# Altium project Power_Embedded_Board.PrjPcb
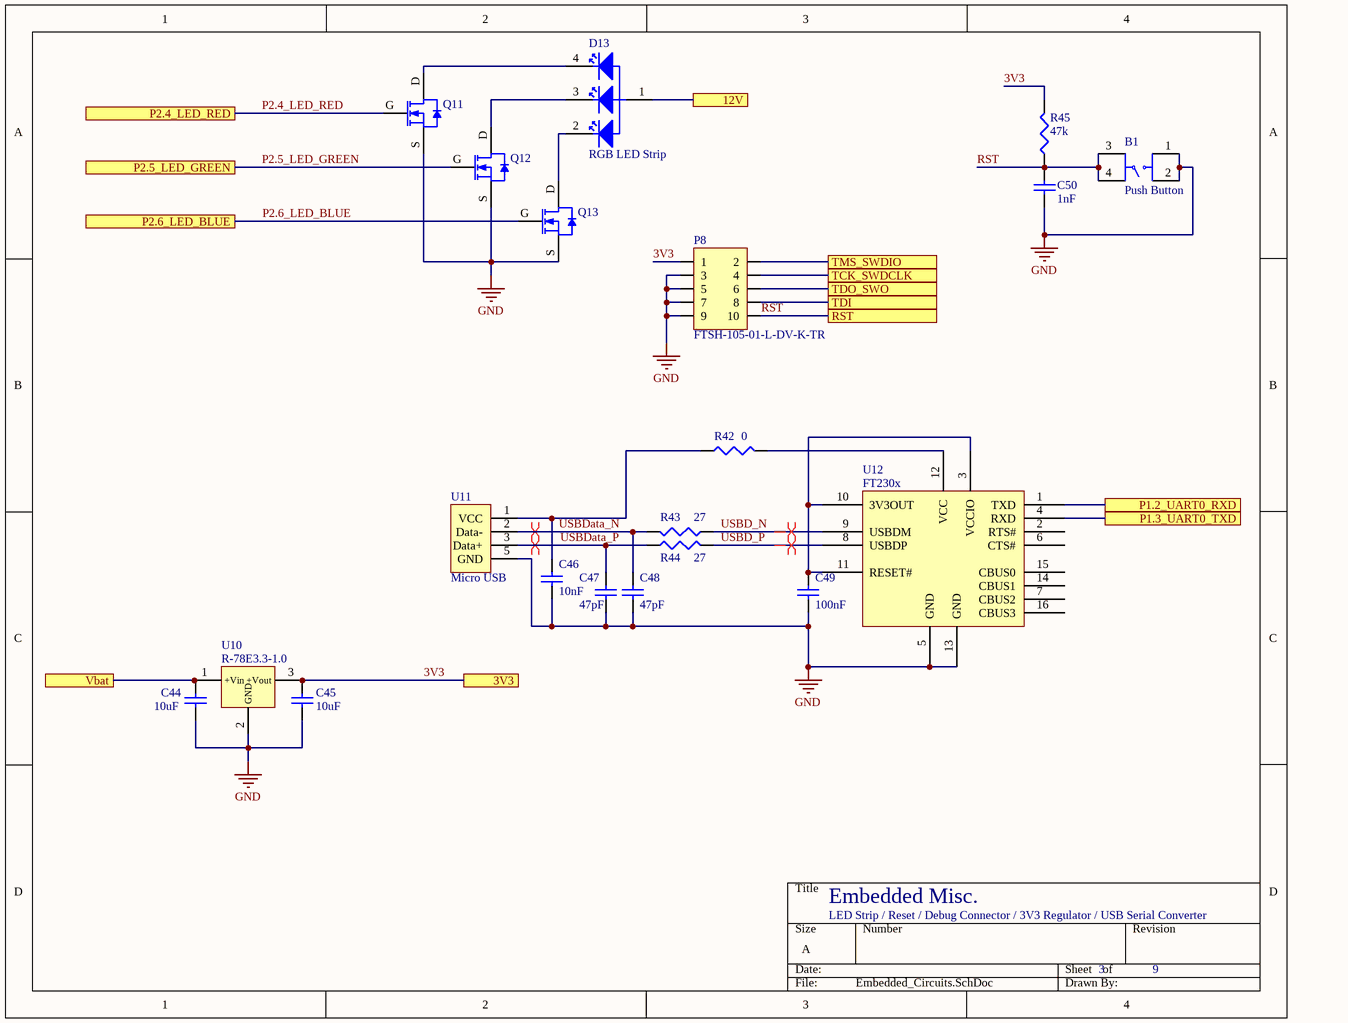
[diagram p0: Embedded_Circuits.SchDoc]
5 sheets, 122 parts. Net scope: flat (ports and power ports of the same name join across sheets).
Board file: Power_Embedded_Board.PcbDoc
Sheets:
  Embedded_Circuits.SchDoc
  Embedded_Chip.SchDoc
  12V_Converter.SchDoc
  19V_Converter.SchDoc
  48V_Converter2.SchDoc

## Sheet Embedded_Circuits.SchDoc
size A; SheetNumber: 3; SheetTotal: 9

### Parts
B1  Push Button  [Push Button]
C44  value 10uF  [C1206]  (hidden comment: Cap)
C45  value 10uF  [C1206]  (hidden comment: Cap)
C46  value 10nF  [C1206]  (hidden comment: Cap)
C47  value 47pF  [C1206]  (hidden comment: Cap)
C48  value 47pF  [C1206]  (hidden comment: Cap)
C49  value 100nF  [C1206]  (hidden comment: Cap)
C50  value 1nF  [C1206]  (hidden comment: Cap Semi)
D13  RGB LED Strip  [Header 1x4]
P8  FTSH-105-01-L-DV-K-TR  [FTSH-105-01-L-DV-K-TR]
Q11  DMN1019USN  [DMN1019USN]  (value not drawn)
Q12  DMN1019USN  [DMN1019USN]  (value not drawn)
Q13  DMN1019USN  [DMN1019USN]  (value not drawn)
R42  value 0  [J1-0603]  (hidden comment: Res3)
R43  value 27  [J1-0603]  (hidden comment: Res3)
R44  value 27  [J1-0603]  (hidden comment: Res3)
R45  value 47k  [J1-0603]  (hidden comment: Res3)
U10  R-78E3.3-1.0  [R-78Exx-1.0]
U11  Micro USB  [Micro USB]
U12  FT230x  [FT230X]

### Ports
3V3, 12V, P1.2_UART0_RXD, P1.3_UART0_TXD, P2.4_LED_RED, P2.5_LED_GREEN, P2.6_LED_BLUE, RST, TCK_SWDCLK, TDI, TDO_SWO, TMS_SWDIO, Vbat

### Nets
GND: B1.1 B1.2 C44.1 C45.1 C46.1 C47.1 C48.1 C49.1 C50.1 P8.3 P8.5 P8.7 P8.9 Q11.S Q12.S Q13.S U10.2(GND) U11.5(GND) U12.5(GND) U12.13(GND)
3V3: C45.2 P8.1 R45.2 U10.3(+Vout) ; port 3V3
P1.2_UART0_RXD: U12.1(TXD) ; port P1.2_UART0_RXD
P1.3_UART0_TXD: U12.4(RXD) ; port P1.3_UART0_TXD
P2.4_LED_RED: Q11.G ; port P2.4_LED_RED
P2.5_LED_GREEN: Q12.G ; port P2.5_LED_GREEN
P2.6_LED_BLUE: Q13.G ; port P2.6_LED_BLUE
RST: B1.3 B1.4 C50.2 P8.10 R45.1 ; port RST
TCK_SWDCLK: P8.4 ; port TCK_SWDCLK
TDI: P8.8 ; port TDI
TDO_SWO: P8.6 ; port TDO_SWO
TMS_SWDIO: P8.2 ; port TMS_SWDIO
USBD_N: R43.1 U12.9(USBDM)
USBD_P: R44.2 U12.8(USBDP)
USBData_N: C48.2 R43.2 U11.2(Data-)
USBData_P: C47.2 R44.1 U11.3(Data+)
Vbat: C44.2 U10.1(+Vin) ; port Vbat
NetC46_2: C46.2 R42.1 U11.1(VCC)
NetC49_2: C49.2 U12.3(VCCIO) U12.10(3V3OUT) U12.11(RESET#)
NetD13_1: D13.1 ; port 12V
NetD13_2: D13.2 Q13.D
NetD13_3: D13.3 Q12.D
NetD13_4: D13.4 Q11.D
NetR42_2: R42.2 U12.12(VCC)

Not connected (* = marked no-connect by the designer): U12 2(RTS#) 6(CTS#) 7(CBUS2) 14(CBUS1) 15(CBUS0) 16(CBUS3)

### Layout directives
differential pair: USBD_N, USBD_P, USBData_N, USBData_P

### Notes on the sheet
- Embedded Misc.
- LED Strip / Reset / Debug Connector / 3V3 Regulator / USB Serial Converter

### Library data of the parts
B1 = Push Button: Tactile Switch SPST-NO Top Actuated Through Hole; Digikey Link: https://www.digikey.com/product-detail/en/te-connectivity-alcoswitch-switches/FSM101/450-1157-ND/701084; Drawing: https://www.te.com/commerce/DocumentDelivery/DDEController?Action=srchrtrv&DocNm=1571140&DocType=Customer+Drawing&DocLang=English
C44-C49 = Cap: Capacitor; Published: 8-Jun-2000; LatestRevisionDate: 17-Jul-2002; LatestRevisionNote: Re-released for DXP Platform.; PackageReference: RAD-0.3; Publisher: Altium Limited; PackageDescription: Radial Cap, Thru-Hole; 2 Leads; 0.3 in Pin Spacing; Supplier 1: Digi-Key
  C44 C45: Supplier Part Number 1: 1276-2872-1-ND
  C46: Supplier Part Number 1: 1276-1921-1-ND
  C47 C48: Supplier Part Number 1: 490-16375-1-ND
  C49: Supplier Part Number 1: 1276-1001-1-ND
C50 = Cap Semi: Capacitor (Semiconductor SIM Model); Published: 8-Jun-2000; LatestRevisionDate: 29-May-2009; LatestRevisionNote: IPC-7351 Footprint Added.; PackageReference: C1206; Publisher: Altium Limited; PackageDescription: Chip Capacitor; Supplier 1: Digi-Key; Supplier Part Number 1: 490-4761-1-ND
D13 = RGB LED Strip: LED RGB Strip - Bare Nonaddressable; Sparkfun Link: https://www.sparkfun.com/products/12021
P8 = JTAG Header: CONN HEADER 10POS DUAL .05" SMD; Digikey Link: https://www.digikey.com/product-detail/en/samtec-inc/FTSH-105-01-L-DV-K-TR/SAM13165CT-ND/8827920; Drawings: http://suddendocs.samtec.com/prints/ftsh-1xx-xx-xxx-dv-xxx-xxx-mkt.pdf; Datasheet: http://suddendocs.samtec.com/catalog_english/ftsh_smt.pdf
Q11-Q13 = DMN1019USN: 12V N-Channel Enhancement Mode MOSFET; Datasheet: https://www.diodes.com/assets/Datasheets/DMN1019USN.pdf
R42-R45 = Res3: Resistor; Published: 8-Jun-2000; LatestRevisionDate: 29-May-2009; LatestRevisionNote: IPC-7351 Footprint Added.; PackageReference: J1-0603; Publisher: Altium Limited; PackageDescription: Chip Resistor
U10 = R-78Exx-1.0: 1A DC/DC Voltage Converter; Datasheet: https://www.recom-power.com/pdf/Innoline/R-78Exx-0.5.pdf
U11 = Micro USB: USB - micro B USB 2.0 Receptacle Connector 5 Position Surface Mount, Right Angle; Digikey: https://www.digikey.com/product-detail/en/molex-llc/1050170001/WM1399CT-ND/2350885; Datasheet: https://www.molex.com/pdm_docs/sd/1050170001_sd.pdf
U12 = FTDI FT230x: USB to Basic UART IC; Datasheet: https://www.ftdichip.com/Support/Documents/DataSheets/ICs/DS_FT230X.pdf

## Sheet Embedded_Chip.SchDoc
size A; SheetNumber: 4; SheetTotal: 9
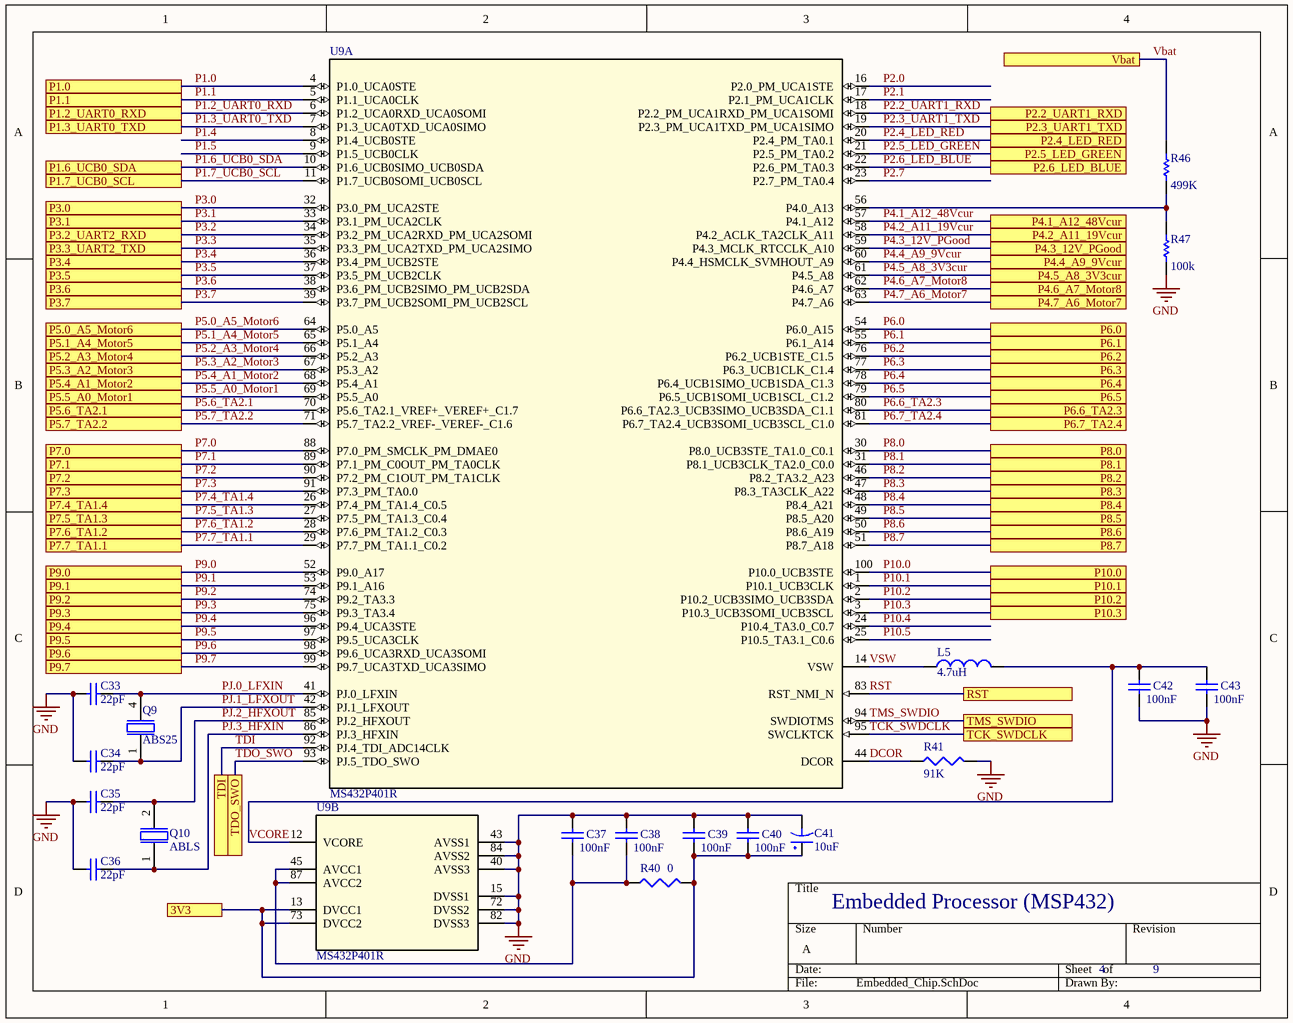
[diagram p1: Embedded_Chip.SchDoc]

### Parts
C33  value 22pF  [C1206]  (hidden comment: Cap Semi)
C34  value 22pF  [C1206]  (hidden comment: Cap Semi)
C35  value 22pF  [C1206]  (hidden comment: Cap Semi)
C36  value 22pF  [C1206]  (hidden comment: Cap Semi)
C37  value 100nF  [C1206]  (hidden comment: Cap Semi)
C38  value 100nF  [C1206]  (hidden comment: Cap Semi)
C39  value 100nF  [C1206]  (hidden comment: Cap Semi)
C40  value 100nF  [C1206]  (hidden comment: Cap Semi)
C41  10uF  [UWX1C100MCL2GB]
C42  value 100nF  [C1206]  (hidden comment: Cap Semi)
C43  value 100nF  [C1206]  (hidden comment: Cap Semi)
L5  value 4.7uH  [0806 (Metric 2016)]  (hidden comment: Inductor)
Q9  ABS25  [ABS25]
Q10  ABLS  [ABLS]
R40  value 0  [J1-0603]  (hidden comment: Res3)
R41  value 91K  [J1-0603]  (hidden comment: Res3)
R46  value 499K  [J1-0603]  (hidden comment: Res1)
R47  value 100k  [J1-0603]  (hidden comment: Res1)
U9  MS432P401R  [PZ0100A_M]  (parts A,B of 2)

### Ports
3V3, P1.0, P1.1, P1.2_UART0_RXD, P1.3_UART0_TXD, P1.6_UCB0_SDA, P1.7_UCB0_SCL, P2.2_UART1_RXD, P2.3_UART1_TXD, P2.4_LED_RED, P2.5_LED_GREEN, P2.6_LED_BLUE, P3.0, P3.1, P3.2_UART2_RXD, P3.3_UART2_TXD, P3.4, P3.5, P3.6, P3.7, P4.1_A12_48Vcur, P4.2_A11_19Vcur, P4.3_12V_PGood, P4.4_A9_9Vcur, P4.5_A8_3V3cur, P4.6_A7_Motor8, P4.7_A6_Motor7, P5.0_A5_Motor6, P5.1_A4_Motor5, P5.2_A3_Motor4, P5.3_A2_Motor3, P5.4_A1_Motor2, P5.5_A0_Motor1, P5.6_TA2.1, P5.7_TA2.2, P6.0, P6.1, P6.2, P6.3, P6.4, P6.5, P6.6_TA2.3, P6.7_TA2.4, P7.0, P7.1, P7.2, P7.3, P7.4_TA1.4, P7.5_TA1.3, P7.6_TA1.2, P7.7_TA1.1, P8.0, P8.1, P8.2, P8.3, P8.4, P8.5, P8.6, P8.7, P9.0, P9.1, P9.2, P9.3, P9.4, P9.5, P9.6, P9.7, P10.0, P10.1, P10.2, P10.3, RST, TCK_SWDCLK, TDI, TDO_SWO, TMS_SWDIO, Vbat

### Nets
GND: C33.1 C34.1 C35.1 C36.1 C37.2 C38.2 C39.2 C40.2 C41.2 C42.1 C43.1 R41.2 R47.1 U9.15(DVSS1) U9.40(AVSS3) U9.43(AVSS1) U9.72(DVSS2) U9.82(DVSS3) U9.84(AVSS2)
3V3: C39.1 C40.1 C41.1 R40.2 U9.13(DVCC1) U9.73(DVCC2) ; port 3V3
DCOR: R41.1 U9.44(DCOR)
P1.0: U9.4(P1.0_UCA0STE) ; port P1.0
P1.1: U9.5(P1.1_UCA0CLK) ; port P1.1
P1.2_UART0_RXD: U9.6(P1.2_UCA0RXD_UCA0SOMI) ; port P1.2_UART0_RXD
P1.3_UART0_TXD: U9.7(P1.3_UCA0TXD_UCA0SIMO) ; port P1.3_UART0_TXD
P1.4: U9.8(P1.4_UCB0STE)
P1.5: U9.9(P1.5_UCB0CLK)
P1.6_UCB0_SDA: U9.10(P1.6_UCB0SIMO_UCB0SDA) ; port P1.6_UCB0_SDA
P1.7_UCB0_SCL: U9.11(P1.7_UCB0SOMI_UCB0SCL) ; port P1.7_UCB0_SCL
P2.0: U9.16(P2.0_PM_UCA1STE)
P2.1: U9.17(P2.1_PM_UCA1CLK)
P2.2_UART1_RXD: U9.18(P2.2_PM_UCA1RXD_PM_UCA1SOMI) ; port P2.2_UART1_RXD
P2.3_UART1_TXD: U9.19(P2.3_PM_UCA1TXD_PM_UCA1SIMO) ; port P2.3_UART1_TXD
P2.4_LED_RED: U9.20(P2.4_PM_TA0.1) ; port P2.4_LED_RED
P2.5_LED_GREEN: U9.21(P2.5_PM_TA0.2) ; port P2.5_LED_GREEN
P2.6_LED_BLUE: U9.22(P2.6_PM_TA0.3) ; port P2.6_LED_BLUE
P2.7: U9.23(P2.7_PM_TA0.4)
P3.0: U9.32(P3.0_PM_UCA2STE) ; port P3.0
P3.1: U9.33(P3.1_PM_UCA2CLK) ; port P3.1
P3.2: U9.34(P3.2_PM_UCA2RXD_PM_UCA2SOMI) ; port P3.2_UART2_RXD
P3.3: U9.35(P3.3_PM_UCA2TXD_PM_UCA2SIMO) ; port P3.3_UART2_TXD
P3.4: U9.36(P3.4_PM_UCB2STE) ; port P3.4
P3.5: U9.37(P3.5_PM_UCB2CLK) ; port P3.5
P3.6: U9.38(P3.6_PM_UCB2SIMO_PM_UCB2SDA) ; port P3.6
P3.7: U9.39(P3.7_PM_UCB2SOMI_PM_UCB2SCL) ; port P3.7
P4.1_A12_48Vcur: U9.57(P4.1_A12) ; port P4.1_A12_48Vcur
P4.2_A11_19Vcur: U9.58(P4.2_ACLK_TA2CLK_A11) ; port P4.2_A11_19Vcur
P4.3_12V_PGood: U9.59(P4.3_MCLK_RTCCLK_A10) ; port P4.3_12V_PGood
P4.4_A9_9Vcur: U9.60(P4.4_HSMCLK_SVMHOUT_A9) ; port P4.4_A9_9Vcur
P4.5_A8_3V3cur: U9.61(P4.5_A8) ; port P4.5_A8_3V3cur
P4.6_A7_Motor8: U9.62(P4.6_A7) ; port P4.6_A7_Motor8
P4.7_A6_Motor7: U9.63(P4.7_A6) ; port P4.7_A6_Motor7
P5.0_A5_Motor6: U9.64(P5.0_A5) ; port P5.0_A5_Motor6
P5.1_A4_Motor5: U9.65(P5.1_A4) ; port P5.1_A4_Motor5
P5.2_A3_Motor4: U9.66(P5.2_A3) ; port P5.2_A3_Motor4
P5.3_A2_Motor3: U9.67(P5.3_A2) ; port P5.3_A2_Motor3
P5.4_A1_Motor2: U9.68(P5.4_A1) ; port P5.4_A1_Motor2
P5.5_A0_Motor1: U9.69(P5.5_A0) ; port P5.5_A0_Motor1
P5.6_TA2.1: U9.70(P5.6_TA2.1_VREF+_VEREF+_C1.7) ; port P5.6_TA2.1
P5.7_TA2.2: U9.71(P5.7_TA2.2_VREF-_VEREF-_C1.6) ; port P5.7_TA2.2
P6.0: U9.54(P6.0_A15) ; port P6.0
P6.1: U9.55(P6.1_A14) ; port P6.1
P6.2: U9.76(P6.2_UCB1STE_C1.5) ; port P6.2
P6.3: U9.77(P6.3_UCB1CLK_C1.4) ; port P6.3
P6.4: U9.78(P6.4_UCB1SIMO_UCB1SDA_C1.3) ; port P6.4
P6.5: U9.79(P6.5_UCB1SOMI_UCB1SCL_C1.2) ; port P6.5
P6.6_TA2.3: U9.80(P6.6_TA2.3_UCB3SIMO_UCB3SDA_C1.1) ; port P6.6_TA2.3
P6.7_TA2.4: U9.81(P6.7_TA2.4_UCB3SOMI_UCB3SCL_C1.0) ; port P6.7_TA2.4
P7.0: U9.88(P7.0_PM_SMCLK_PM_DMAE0) ; port P7.0
P7.1: U9.89(P7.1_PM_C0OUT_PM_TA0CLK) ; port P7.1
P7.2: U9.90(P7.2_PM_C1OUT_PM_TA1CLK) ; port P7.2
P7.3: U9.91(P7.3_PM_TA0.0) ; port P7.3
P7.4_TA1.4: U9.26(P7.4_PM_TA1.4_C0.5) ; port P7.4_TA1.4
P7.5_TA1.3: U9.27(P7.5_PM_TA1.3_C0.4) ; port P7.5_TA1.3
P7.6_TA1.2: U9.28(P7.6_PM_TA1.2_C0.3) ; port P7.6_TA1.2
P7.7_TA1.1: U9.29(P7.7_PM_TA1.1_C0.2) ; port P7.7_TA1.1
P8.0: U9.30(P8.0_UCB3STE_TA1.0_C0.1) ; port P8.0
P8.1: U9.31(P8.1_UCB3CLK_TA2.0_C0.0) ; port P8.1
P8.2: U9.46(P8.2_TA3.2_A23) ; port P8.2
P8.3: U9.47(P8.3_TA3CLK_A22) ; port P8.3
P8.4: U9.48(P8.4_A21) ; port P8.4
P8.5: U9.49(P8.5_A20) ; port P8.5
P8.6: U9.50(P8.6_A19) ; port P8.6
P8.7: U9.51(P8.7_A18) ; port P8.7
P9.0: U9.52(P9.0_A17) ; port P9.0
P9.1: U9.53(P9.1_A16) ; port P9.1
P9.2: U9.74(P9.2_TA3.3) ; port P9.2
P9.3: U9.75(P9.3_TA3.4) ; port P9.3
P9.4: U9.96(P9.4_UCA3STE) ; port P9.4
P9.5: U9.97(P9.5_UCA3CLK) ; port P9.5
P9.6: U9.98(P9.6_UCA3RXD_UCA3SOMI) ; port P9.6
P9.7: U9.99(P9.7_UCA3TXD_UCA3SIMO) ; port P9.7
P10.0: U9.100(P10.0_UCB3STE) ; port P10.0
P10.1: U9.1(P10.1_UCB3CLK) ; port P10.1
P10.2: U9.2(P10.2_UCB3SIMO_UCB3SDA) ; port P10.2
P10.3: U9.3(P10.3_UCB3SOMI_UCB3SCL) ; port P10.3
P10.4: U9.24(P10.4_TA3.0_C0.7)
P10.5: U9.25(P10.5_TA3.1_C0.6)
PJ.0_LFXIN: C33.2 Q9.4 U9.41(PJ.0_LFXIN)
PJ.1_LFXOUT: C34.2 Q9.1 U9.42(PJ.1_LFXOUT)
PJ.2_HFXOUT: C35.2 Q10.2 U9.85(PJ.2_HFXOUT)
PJ.3_HFXIN: C36.2 Q10.1 U9.86(PJ.3_HFXIN)
RST: U9.83(RST_NMI_N) ; port RST
TCK_SWDCLK: U9.95(SWCLKTCK) ; port TCK_SWDCLK
TDI: U9.92(PJ.4_TDI_ADC14CLK) ; port TDI
TDO_SWO: U9.93(PJ.5_TDO_SWO) ; port TDO_SWO
TMS_SWDIO: U9.94(SWDIOTMS) ; port TMS_SWDIO
Vbat: R46.2 ; port Vbat
VCORE: C42.2 C43.2 L5.2 U9.12(VCORE)
VSW: L5.1 U9.14(VSW)
NetC37_1: C37.1 C38.1 R40.1 U9.45(AVCC1) U9.87(AVCC2)
NetR46_1: R46.1 R47.2 U9.56(P4.0_A13)

### Notes on the sheet
- Embedded Processor (MSP432)

### Library data of the parts
C33-C40 C42 C43 = Cap Semi: Capacitor (Semiconductor SIM Model); Published: 8-Jun-2000; LatestRevisionDate: 29-May-2009; LatestRevisionNote: IPC-7351 Footprint Added.; PackageReference: C1206; Publisher: Altium Limited; PackageDescription: Chip Capacitor
C41 = UWX1C100MCL2GB: CAP ALUM 10UF 20% 16V SMD; Digikey: https://www.digikey.com/product-detail/en/nichicon/UWX1C100MCL2GB/493-2099-1-ND/590074; Datasheet: http://nichicon-us.com/english/products/pdfs/e-uwx.pdf
L5 = Inductor: Code_IEC: 1005; Published: 8-Jun-2000; LatestRevisionDate: 29-May-2009; LatestRevisionNote: IPC-7351 Footprint Added.; PackageReference: 0402-A; Publisher: Altium Limited; PackageDescription: Chip Inductor; Code_JEITA: 0402; Supplier 1: Digi-Key; Supplier Part Number 1: 732-2956-1-ND
Q9 = ABS25: 32.768 kHz Low Frequency SMD Crystal; Datasheet: https://abracon.com/Resonators/abs25.pdf
Q10 = ABLS: SMD Low Profile Crystal - 3.579545 MHz to 75 MHz; Datasheet: https://abracon.com/Resonators/abls.pdf
R40 R41 = Res3: Resistor; Published: 8-Jun-2000; LatestRevisionDate: 29-May-2009; LatestRevisionNote: IPC-7351 Footprint Added.; PackageReference: J1-0603; Publisher: Altium Limited; PackageDescription: Chip Resistor
R46 R47 = Res1: Resistor; Published: 8-Jun-2000; LatestRevisionDate: 17-Jul-2002; LatestRevisionNote: Re-released for DXP Platform.; PackageReference: AXIAL-0.3; Publisher: Altium Limited; PackageDescription: Axial Device, Thru-Hole; 2 Leads; 0.3 in Pin Spacing
U9 = MS432P401R-IPZR: SimpleLink Ultra-Low-Power 32-Bit ARM Cortex-M4F MCU With Precision ADC, 256KB Flash and 64KB RAM; PartNumber: XMS432P401RIPZR; Manufacturer: Texas Instruments; CompType: IC; PIN_COUNT: 100; PackageReference: PZ0100A; MountType: SMT; RefDes: RefDes; TYPE: TYPE; Value: Value

## Sheet 12V_Converter.SchDoc
size A; SheetNumber: 6; SheetTotal: 9
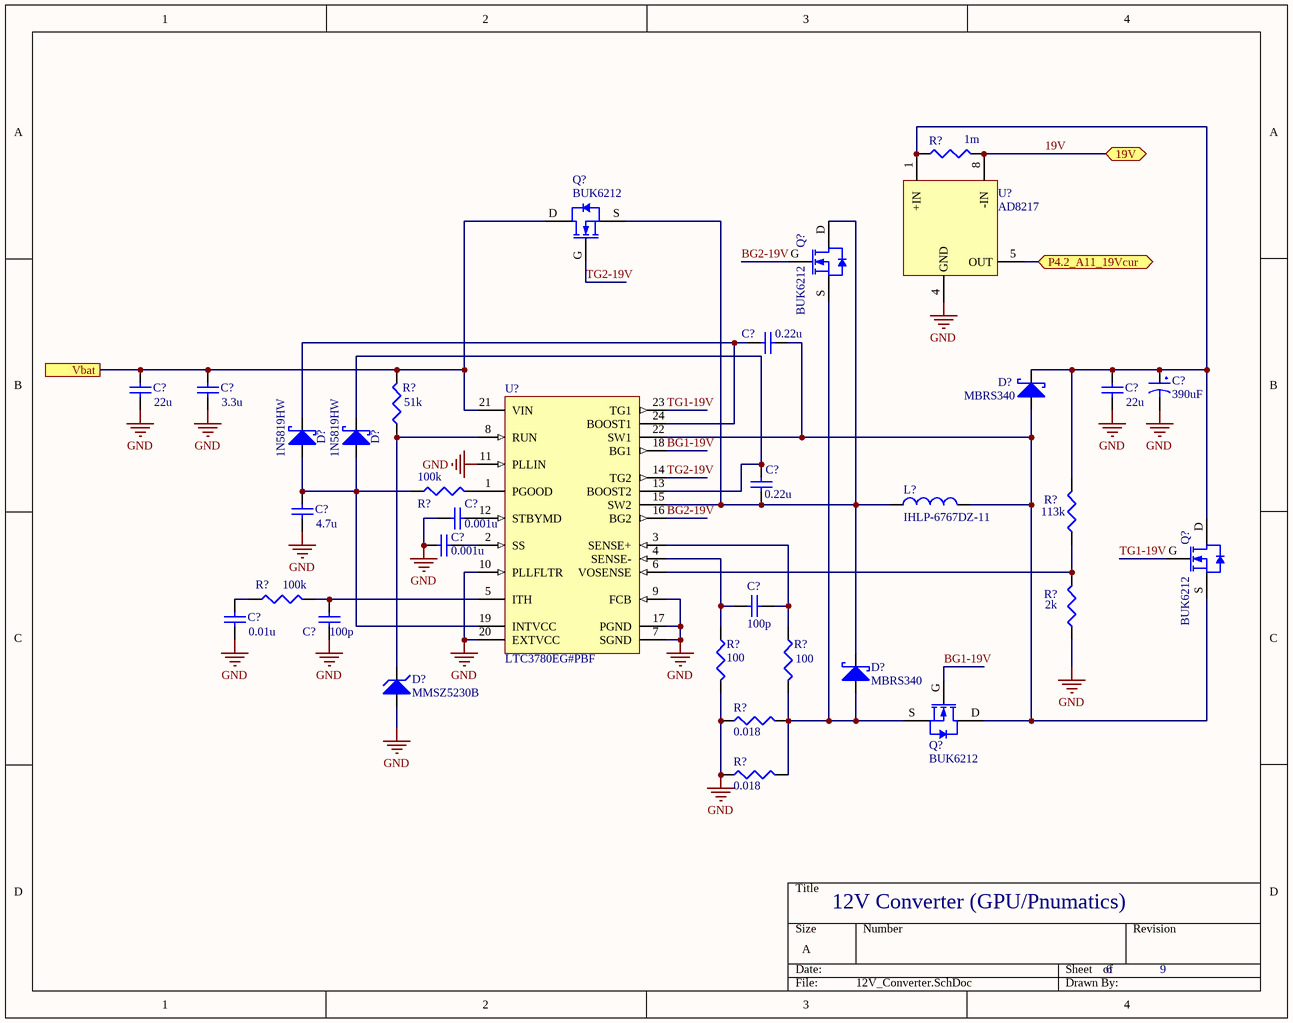
[diagram p2: 12V_Converter.SchDoc]

### Parts
(Parts that share a designator on the sheet are numbered #1, #2 ... from top to bottom, then left to right.)
C?#1  value 0.22u  [C1206]  (hidden comment: Cap Semi)
C?#2  value 22u  [C1206]  (hidden comment: Cap Semi)
C?#3  value 3.3u  [C1206]  (hidden comment: Cap Semi)
C?#4  value 22u  [C1206]  (hidden comment: Cap Semi)
C?#5  390uF  [PCVxxxxxMCLxGS]
C?#6  value 0.22u  [C1206]  (hidden comment: Cap Semi)
C?#7  value 0.001u  [C1206]  (hidden comment: Cap Semi)
C?#8  value 4.7u  [C1206]  (hidden comment: Cap Semi)
C?#9  value 0.001u  [C1206]  (hidden comment: Cap Semi)
C?#10  value 100p  [C1206]  (hidden comment: Cap Semi)
C?#11  value 0.01u  [C1206]  (hidden comment: Cap Semi)
C?#12  value 100p  [C1206]  (hidden comment: Cap Semi)
D?#1  MBRS340  [MBRS340]
D?#2  1N5819HW  [1N58xx]
D?#3  1N5819HW  [1N58xx]
D?#4  MMSZ5230B  [ONSC-SOD-123-2-425-04_V]
D?#5  MBRS340  [MBRS340]
L?  IHLP-6767DZ-11  [IHLP-6767DZ-11]
Q?#1  BUK6212  [NXP-SOT428_M]
Q?#2  BUK6212  [NXP-SOT428_M]
Q?#3  BUK6212  [NXP-SOT428_M]
Q?#4  BUK6212  [NXP-SOT428_M]
R?#1  value 1m  [14-1210]  (hidden comment: Res3)
R?#2  value 51k  [J1-0603]  (hidden comment: Res3)
R?#3  value 100k  [J1-0603]  (hidden comment: Res3)
R?#4  value 113k  [J1-0603]  (hidden comment: Res3)
R?#5  value 100k  [J1-0603]  (hidden comment: Res3)
R?#6  value 2k  [J1-0603]  (hidden comment: Res3)
R?#7  value 100  [J1-0603]  (hidden comment: Res3)
R?#8  value 100  [J1-0603]  (hidden comment: Res3)
R?#9  value 0.018  [R1206]  (hidden comment: Res3)
R?#10  value 0.018  [R1206]  (hidden comment: Res3)
U?#1  AD8217  [AD8217]
U?#2  LTC3780EG#PBF  [LT-G-24_L]

### Ports
19V (bidir), P4.2_A11_19Vcur (bidir), Vbat

### Nets
GND: C?#2.1 C?#3.1 C?#4.1 C?#5.2 C?#7.1 C?#8.1 C?#9.1 C?#11.1 C?#12.1 D?#4.2(A) R?#6.1 R?#7.2 R?#9.1 R?#10.1 U?#1.4(GND) U?#2.7(SGND) U?#2.9(FCB) U?#2.10(PLLFLTR) U?#2.11(PLLIN) U?#2.17(PGND) U?#2.20(EXTVCC)
19V: R?#1.2 U?#1.8(-IN) ; port 19V
BG1-19V: Q?#4.G U?#2.18(BG1)
BG2-19V: Q?#2.G U?#2.16(BG2)
P4.2_A11_19Vcur: U?#1.5(OUT) ; port P4.2_A11_19Vcur
TG1-19V: Q?#3.G U?#2.23(TG1)
TG2-19V: Q?#1.G U?#2.14(TG2)
Vbat: C?#2.2 C?#3.2 Q?#1.D R?#2.2 U?#2.21(VIN) ; port Vbat
NetC?#1_1: C?#1.1 D?#1.A(Anode) L?.2 Q?#3.S Q?#4.D U?#2.22(SW1)
NetC?#1_2: C?#1.2 D?#2.K(Cathode) U?#2.24(BOOST1)
NetC?#4_2: C?#4.2 C?#5.1 D?#1.K(Cathode) Q?#3.D R?#1.1 R?#4.2 U?#1.1(+IN)
NetC?#6_1: C?#6.1 D?#5.K(Cathode) L?.1 Q?#1.S Q?#2.D U?#2.15(SW2)
NetC?#6_2: C?#6.2 D?#3.K(Cathode) U?#2.13(BOOST2)
NetC?#7_2: C?#7.2 U?#2.12(STBYMD)
NetC?#8_2: C?#8.2 D?#2.A(Anode) D?#3.A(Anode) R?#3.1 U?#2.19(INTVCC)
NetC?#9_2: C?#9.2 U?#2.2(SS)
NetC?#10_1: C?#10.1 R?#7.1 U?#2.4(SENSE-)
NetC?#10_2: C?#10.2 R?#8.1 U?#2.3(SENSE+)
NetC?#11_2: C?#11.2 R?#5.1
NetC?#12_2: C?#12.2 R?#5.2 U?#2.5(ITH)
NetD?#4_1: D?#4.1(K) R?#2.1 U?#2.8(RUN)
NetD?#5_A: D?#5.A(Anode) Q?#2.S Q?#4.S R?#8.2 R?#9.2 R?#10.2
NetR?#3_2: R?#3.2 U?#2.1(PGOOD)
NetR?#4_1: R?#4.1 R?#6.2 U?#2.6(VOSENSE)

### Notes on the sheet
- 12V Converter (GPU/Pnumatics)

### Library data of the parts
C?#1-C?#4 C?#6-C?#12 = Cap Semi: Capacitor (Semiconductor SIM Model); Published: 8-Jun-2000; LatestRevisionDate: 29-May-2009; LatestRevisionNote: IPC-7351 Footprint Added.; PackageReference: C1206; Publisher: Altium Limited; PackageDescription: Chip Capacitor
C?#5 = PCV1E391MCL2GS: CAP ALUM POLY 390UF 20% 25V SMD; Digikey: https://www.digikey.com/product-detail/en/nichicon/PCV1E391MCL2GS/493-4544-1-ND/2786841; Datasheet: http://nichicon-us.com/english/products/pdfs/e-pcv.pdf
D?#1 D?#5 = MBRS340: Schottky Rectifier; Datasheet: https://www.mouser.com/ds/2/308/MBRS340-1120985.pdf
D?#2 D?#3 = 1N58xx: 1A Schottky Barrier Rectifier Diode; Datasheet: http://www.kesenes.com/pdf/1n5817-1n5819.pdf
D?#4 = MMSZ5230BT1G: Zener Voltage Regulator, 500 mW, 2-Pin SOD-123, Pb-Free, Tape and Reel; Manufacturer: On Semiconductor; P Max (W): 0.5; VZ Typ (V): 4.7; DatasheetVersion: Rev. 12; PackageVersion: Rev. G, 10/2009; PackageReference: SOD-123-2-425-04; PackageDescription: 2-Pin SOD, Body 1.6 x 2.69 mm; Supplier 1: Digi-Key; Supplier Part Number 1: MMSZ5230BT1GOSTR-ND; Supplier 2: Digi-Key; Supplier Part Number 2: MMSZ5230BT1GOSCT-ND; Supplier 3: Digi-Key; Supplier Part Number 3: MMSZ5230BT1GOSDKR-ND; Supplier 4: Farnell; Supplier Part Number 4: 1431272; Supplier 5: Farnell; Supplier Part Number 5: 1431272RL; Supplier 6: Farnell; Supplier Part Number 6: 2370826; Supplier 7: Newark; Supplier Part Number 7: 83H7423; Supplier 8: Newark; Supplier Part Number 8: 67R1368; Supplier 9: Mouser; Supplier Part Number 9: 863-MMSZ5230BT1G; Packing: Tape and Reel; RoHS: Pb-Free; Mounting Technology: Surface Mount; PartNumber: MMSZ5230BT1G; ComponentLink1Description: Manufacturer URL; ComponentLink1URL: http://www.onsemi.com/; ComponentLink2Description: Datasheet; ComponentLink2URL: http://www.onsemi.com/pub_link/Collateral/MMSZ5221BT1-D.PDF; ComponentLink3Description: Package Specification; ComponentLink3URL: http://www.onsemi.com/pub_link/Collateral/425-04.PDF
L? = IHLP-6767DZ-11: 15µH Shielded Molded Inductor 14A 14.4 mOhm Max Nonstandard; Datasheet: http://www.vishay.com/docs/34306/lp67dz11.pdf; Digikey: https://www.digikey.com/product-detail/en/vishay-dale/IHLP6767GZER150M11/541-1287-1-ND/2139413
Q?#1-Q?#4 = BUK6212: N-Channel TrenchMOS Intermediate Level FET, 40 V, 50 A, 3-Pin SOT428, Tape and Reel; Manufacturer: NXP Semiconductors; PartNumber: BUK6212-40C,118; Automotive Qualified: Y; Channel Type: N; ID [max] (A): 50; IDM [max] (A): 233; Packing: Tape & Reel; Qr [typ] (nC): 38; VDS [max] (V): 40; VGSth [typ] (V): 2.3; DatasheetVersion: Rev. 2; PackageVersion: 14-06-10, 06/2014; PackageReference: SOT428; PackageDescription: 3-Pin Plastic Single-ended Surface Mounted Package, Body 6.1 x 6.6 mm, Pitch 2.285 mm; Supplier 1: Digi-Key; Supplier Part Number 1: 568-6983-2-ND; Supplier 2: Digi-Key; Supplier Part Number 2: 568-6983-1-ND; Supplier 3: Digi-Key; Supplier Part Number 3: 568-6983-6-ND; Supplier 4: Mouser; Supplier Part Number 4: 771-BUK621240C118; Mounting Technology: Surface Mount; Code_JEITA: SC-63; Code_JEDEC: TO-252; ComponentLink1Description: Manufacturer URL; ComponentLink1URL: http://www.nxp.com/; ComponentLink2Description: Datasheet; ComponentLink2URL: http://www.nxp.com/documents/data_sheet/BUK6212-40C.pdf; ComponentLink3Description: Package Specification; ComponentLink3URL: http://www.nxp.com/documents/outline_drawing/sot428_po.pdf
R?#1-R?#10 = Res3: Resistor; Published: 8-Jun-2000; LatestRevisionDate: 29-May-2009; LatestRevisionNote: IPC-7351 Footprint Added.; PackageReference: J1-0603; Publisher: Altium Limited; PackageDescription: Chip Resistor
U?#1 = AD8217: High Resolution, Zero-Drift  Current Shunt Monitor; Datasheet: https://www.analog.com/media/en/technical-documentation/data-sheets/AD8217.pdf
U?#2 = LTC3780EG#PBF: Buck-boost Controller, Constant Frequency, Current Mode Control with Power Good Output, 24-pin SOP (G-24), -40 to 85 degC, Pb-Free; Manufacturer: Linear Technology; Frequency Sync Range: 200kHz - 400kHz; Number of Outputs: 1; DatasheetVersion: Rev. F; PackageVersion: Jun-10; PackageReference: G-24; PackageDescription: 24-Pin Plastic SSOP, Body 8.2 x 5.3 mm, Pitch 0.65 mm; Supplier 1: Digi-Key; Supplier Part Number 1: LTC3780EG#PBF-ND; Supplier 2: Farnell; Supplier Part Number 2: 1273545; Supplier 3: Newark; Supplier Part Number 3: 56M8395; RoHS: TRUE; Mounting Technology: Surface Mount; PartNumber: LTC3780EG#PBF; ComponentLink1Description: Manufacturer URL; ComponentLink1URL: http://www.linear.com/; ComponentLink2Description: Datasheet; ComponentLink2URL: http://cds.linear.com/docs/en/datasheet/3780ff.pdf; ComponentLink3Description: Package Specification; ComponentLink3URL: http://cds.linear.com/docs/en/packaging/SSOP_24_05-08-1640.pdf

## Sheet 19V_Converter.SchDoc
size A; SheetNumber: 7; SheetTotal: 9
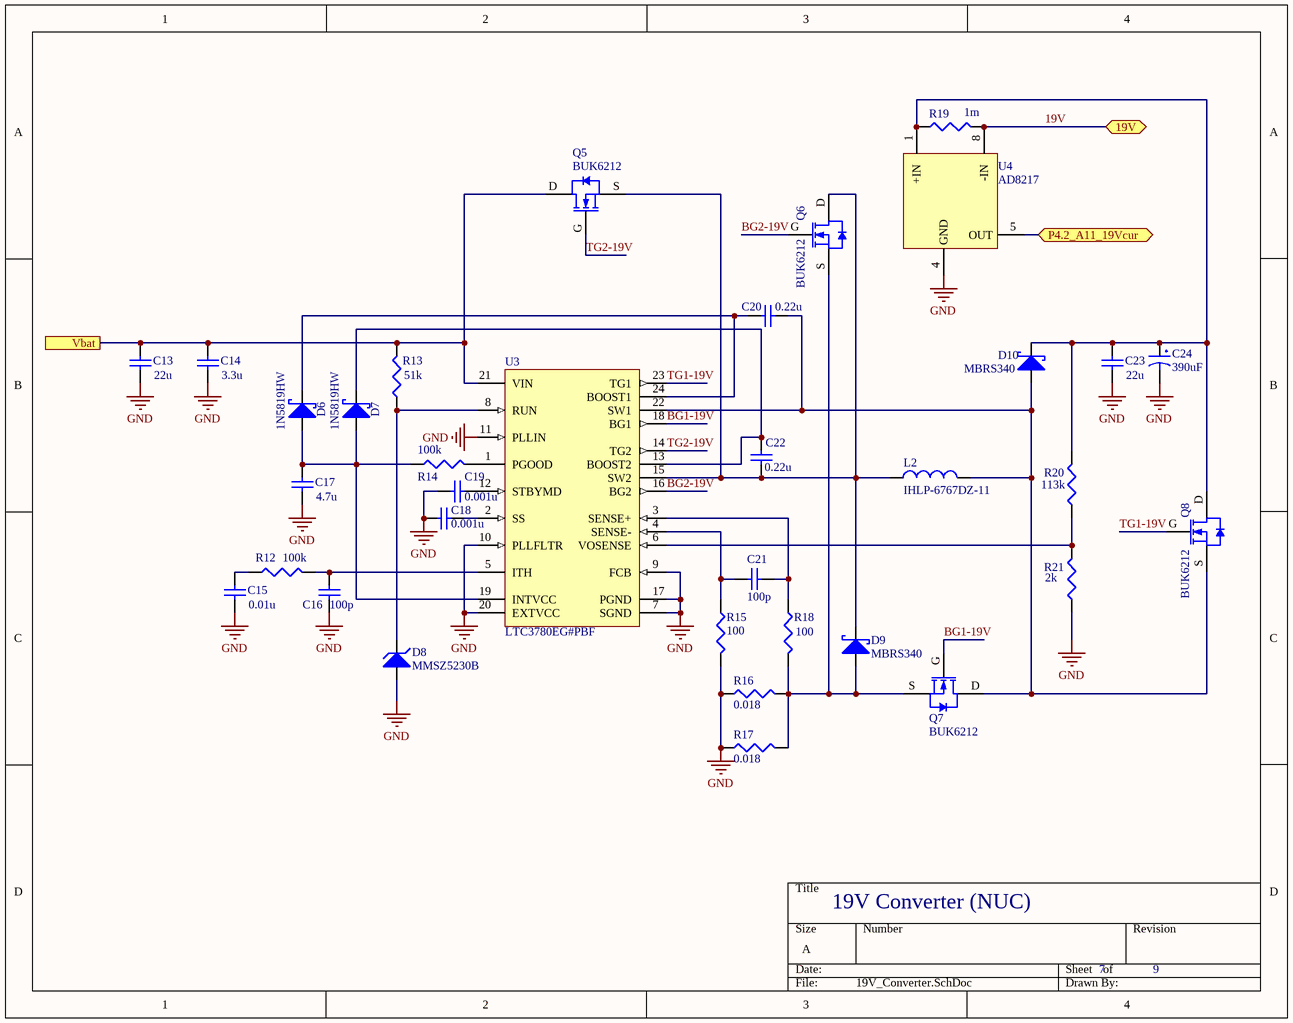
[diagram p3: 19V_Converter.SchDoc]

### Parts
C13  value 22u  [C1206]  (hidden comment: Cap Semi)
C14  value 3.3u  [C1206]  (hidden comment: Cap Semi)
C15  value 0.01u  [C1206]  (hidden comment: Cap Semi)
C16  value 100p  [C1206]  (hidden comment: Cap Semi)
C17  value 4.7u  [C1206]  (hidden comment: Cap Semi)
C18  value 0.001u  [C1206]  (hidden comment: Cap Semi)
C19  value 0.001u  [C1206]  (hidden comment: Cap Semi)
C20  value 0.22u  [C1206]  (hidden comment: Cap Semi)
C21  value 100p  [C1206]  (hidden comment: Cap Semi)
C22  value 0.22u  [C1206]  (hidden comment: Cap Semi)
C23  value 22u  [C1206]  (hidden comment: Cap Semi)
C24  390uF  [PCVxxxxxMCLxGS]
D6  1N5819HW  [1N58xx]
D7  1N5819HW  [1N58xx]
D8  MMSZ5230B  [ONSC-SOD-123-2-425-04_V]
D9  MBRS340  [MBRS340]
D10  MBRS340  [MBRS340]
L2  IHLP-6767DZ-11  [IHLP-6767DZ-11]
Q5  BUK6212  [NXP-SOT428_M]
Q6  BUK6212  [NXP-SOT428_M]
Q7  BUK6212  [NXP-SOT428_M]
Q8  BUK6212  [NXP-SOT428_M]
R12  value 100k  [J1-0603]  (hidden comment: Res3)
R13  value 51k  [J1-0603]  (hidden comment: Res3)
R14  value 100k  [J1-0603]  (hidden comment: Res3)
R15  value 100  [J1-0603]  (hidden comment: Res3)
R16  value 0.018  [R1206]  (hidden comment: Res3)
R17  value 0.018  [R1206]  (hidden comment: Res3)
R18  value 100  [J1-0603]  (hidden comment: Res3)
R19  value 1m  [14-1210]  (hidden comment: Res3)
R20  value 113k  [J1-0603]  (hidden comment: Res3)
R21  value 2k  [J1-0603]  (hidden comment: Res3)
U3  LTC3780EG#PBF  [LT-G-24_L]
U4  AD8217  [AD8217]

### Ports
19V (bidir), P4.2_A11_19Vcur (bidir), Vbat

### Nets
GND: C13.1 C14.1 C15.1 C16.1 C17.1 C18.1 C19.1 C23.1 C24.2 D8.2(A) R15.2 R16.1 R17.1 R21.1 U3.7(SGND) U3.9(FCB) U3.10(PLLFLTR) U3.11(PLLIN) U3.17(PGND) U3.20(EXTVCC) U4.4(GND)
19V: R19.2 U4.8(-IN) ; port 19V
BG1-19V: Q7.G U3.18(BG1)
BG2-19V: Q6.G U3.16(BG2)
P4.2_A11_19Vcur: U4.5(OUT) ; port P4.2_A11_19Vcur
TG1-19V: Q8.G U3.23(TG1)
TG2-19V: Q5.G U3.14(TG2)
Vbat: C13.2 C14.2 Q5.D R13.2 U3.21(VIN) ; port Vbat
NetC15_2: C15.2 R12.1
NetC16_2: C16.2 R12.2 U3.5(ITH)
NetC17_2: C17.2 D6.A(Anode) D7.A(Anode) R14.1 U3.19(INTVCC)
NetC18_2: C18.2 U3.2(SS)
NetC19_2: C19.2 U3.12(STBYMD)
NetC20_1: C20.1 D10.A(Anode) L2.2 Q7.D Q8.S U3.22(SW1)
NetC20_2: C20.2 D6.K(Cathode) U3.24(BOOST1)
NetC21_1: C21.1 R15.1 U3.4(SENSE-)
NetC21_2: C21.2 R18.1 U3.3(SENSE+)
NetC22_1: C22.1 D9.K(Cathode) L2.1 Q5.S Q6.D U3.15(SW2)
NetC22_2: C22.2 D7.K(Cathode) U3.13(BOOST2)
NetC23_2: C23.2 C24.1 D10.K(Cathode) Q8.D R19.1 R20.2 U4.1(+IN)
NetD8_1: D8.1(K) R13.1 U3.8(RUN)
NetD9_A: D9.A(Anode) Q6.S Q7.S R16.2 R17.2 R18.2
NetR14_2: R14.2 U3.1(PGOOD)
NetR20_1: R20.1 R21.2 U3.6(VOSENSE)

### Notes on the sheet
- 19V Converter (NUC)

### Library data of the parts
C13-C23 = Cap Semi: Capacitor (Semiconductor SIM Model); Published: 8-Jun-2000; LatestRevisionDate: 29-May-2009; LatestRevisionNote: IPC-7351 Footprint Added.; PackageReference: C1206; Publisher: Altium Limited; PackageDescription: Chip Capacitor
C24 = PCV1E391MCL2GS: CAP ALUM POLY 390UF 20% 25V SMD; Digikey: https://www.digikey.com/product-detail/en/nichicon/PCV1E391MCL2GS/493-4544-1-ND/2786841; Datasheet: http://nichicon-us.com/english/products/pdfs/e-pcv.pdf
D6 D7 = 1N58xx: 1A Schottky Barrier Rectifier Diode; Datasheet: http://www.kesenes.com/pdf/1n5817-1n5819.pdf
D8 = MMSZ5230BT1G: as D?#4 on sheet 12V_Converter; DatasheetVersion: Rev. 12; PackageVersion: Rev. G, 10/2009; PackageReference: SOD-123-2-425-04; PackageDescription: 2-Pin SOD, Body 1.6 x 2.69 mm; Supplier 1: Digi-Key; Supplier Part Number 1: MMSZ5230BT1GOSTR-ND; Supplier 2: Digi-Key; Supplier Part Number 2: MMSZ5230BT1GOSCT-ND; Supplier 3: Digi-Key; Supplier Part Number 3: MMSZ5230BT1GOSDKR-ND; Supplier 4: Farnell; Supplier Part Number 4: 1431272; Supplier 5: Farnell; Supplier Part Number 5: 1431272RL; Supplier 6: Farnell; Supplier Part Number 6: 2370826; Supplier 7: Newark; Supplier Part Number 7: 83H7423; Supplier 8: Newark; Supplier Part Number 8: 67R1368; Supplier 9: Mouser; Supplier Part Number 9: 863-MMSZ5230BT1G; Packing: Tape and Reel; RoHS: Pb-Free; Mounting Technology: Surface Mount; PartNumber: MMSZ5230BT1G; ComponentLink1Description: Manufacturer URL; ComponentLink1URL: http://www.onsemi.com/; ComponentLink2Description: Datasheet; ComponentLink2URL: http://www.onsemi.com/pub_link/Collateral/MMSZ5221BT1-D.PDF; ComponentLink3Description: Package Specification; ComponentLink3URL: http://www.onsemi.com/pub_link/Collateral/425-04.PDF
D9 D10 = MBRS340: Schottky Rectifier; Datasheet: https://www.mouser.com/ds/2/308/MBRS340-1120985.pdf
L2 = IHLP-6767DZ-11: as L? on sheet 12V_Converter; Datasheet: http://www.vishay.com/docs/34306/lp67dz11.pdf; Digikey: https://www.digikey.com/product-detail/en/vishay-dale/IHLP6767GZER150M11/541-1287-1-ND/2139413
Q5-Q8 = BUK6212: as Q?#1 on sheet 12V_Converter; DatasheetVersion: Rev. 2; PackageVersion: 14-06-10, 06/2014; PackageReference: SOT428; PackageDescription: 3-Pin Plastic Single-ended Surface Mounted Package, Body 6.1 x 6.6 mm, Pitch 2.285 mm; Supplier 1: Digi-Key; Supplier Part Number 1: 568-6983-2-ND; Supplier 2: Digi-Key; Supplier Part Number 2: 568-6983-1-ND; Supplier 3: Digi-Key; Supplier Part Number 3: 568-6983-6-ND; Supplier 4: Mouser; Supplier Part Number 4: 771-BUK621240C118; Mounting Technology: Surface Mount; Code_JEITA: SC-63; Code_JEDEC: TO-252; ComponentLink1Description: Manufacturer URL; ComponentLink1URL: http://www.nxp.com/; ComponentLink2Description: Datasheet; ComponentLink2URL: http://www.nxp.com/documents/data_sheet/BUK6212-40C.pdf; ComponentLink3Description: Package Specification; ComponentLink3URL: http://www.nxp.com/documents/outline_drawing/sot428_po.pdf
R12-R21 = Res3: Resistor; Published: 8-Jun-2000; LatestRevisionDate: 29-May-2009; LatestRevisionNote: IPC-7351 Footprint Added.; PackageReference: J1-0603; Publisher: Altium Limited; PackageDescription: Chip Resistor
U3 = LTC3780EG#PBF: as U?#2 on sheet 12V_Converter; DatasheetVersion: Rev. F; PackageVersion: Jun-10; PackageReference: G-24; PackageDescription: 24-Pin Plastic SSOP, Body 8.2 x 5.3 mm, Pitch 0.65 mm; Supplier 1: Digi-Key; Supplier Part Number 1: LTC3780EG#PBF-ND; Supplier 2: Farnell; Supplier Part Number 2: 1273545; Supplier 3: Newark; Supplier Part Number 3: 56M8395; RoHS: TRUE; Mounting Technology: Surface Mount; PartNumber: LTC3780EG#PBF; ComponentLink1Description: Manufacturer URL; ComponentLink1URL: http://www.linear.com/; ComponentLink2Description: Datasheet; ComponentLink2URL: http://cds.linear.com/docs/en/datasheet/3780ff.pdf; ComponentLink3Description: Package Specification; ComponentLink3URL: http://cds.linear.com/docs/en/packaging/SSOP_24_05-08-1640.pdf
U4 = AD8217: as U?#1 on sheet 12V_Converter; Datasheet: https://www.analog.com/media/en/technical-documentation/data-sheets/AD8217.pdf

## Sheet 48V_Converter2.SchDoc
size A; SheetNumber: 9; SheetTotal: 9
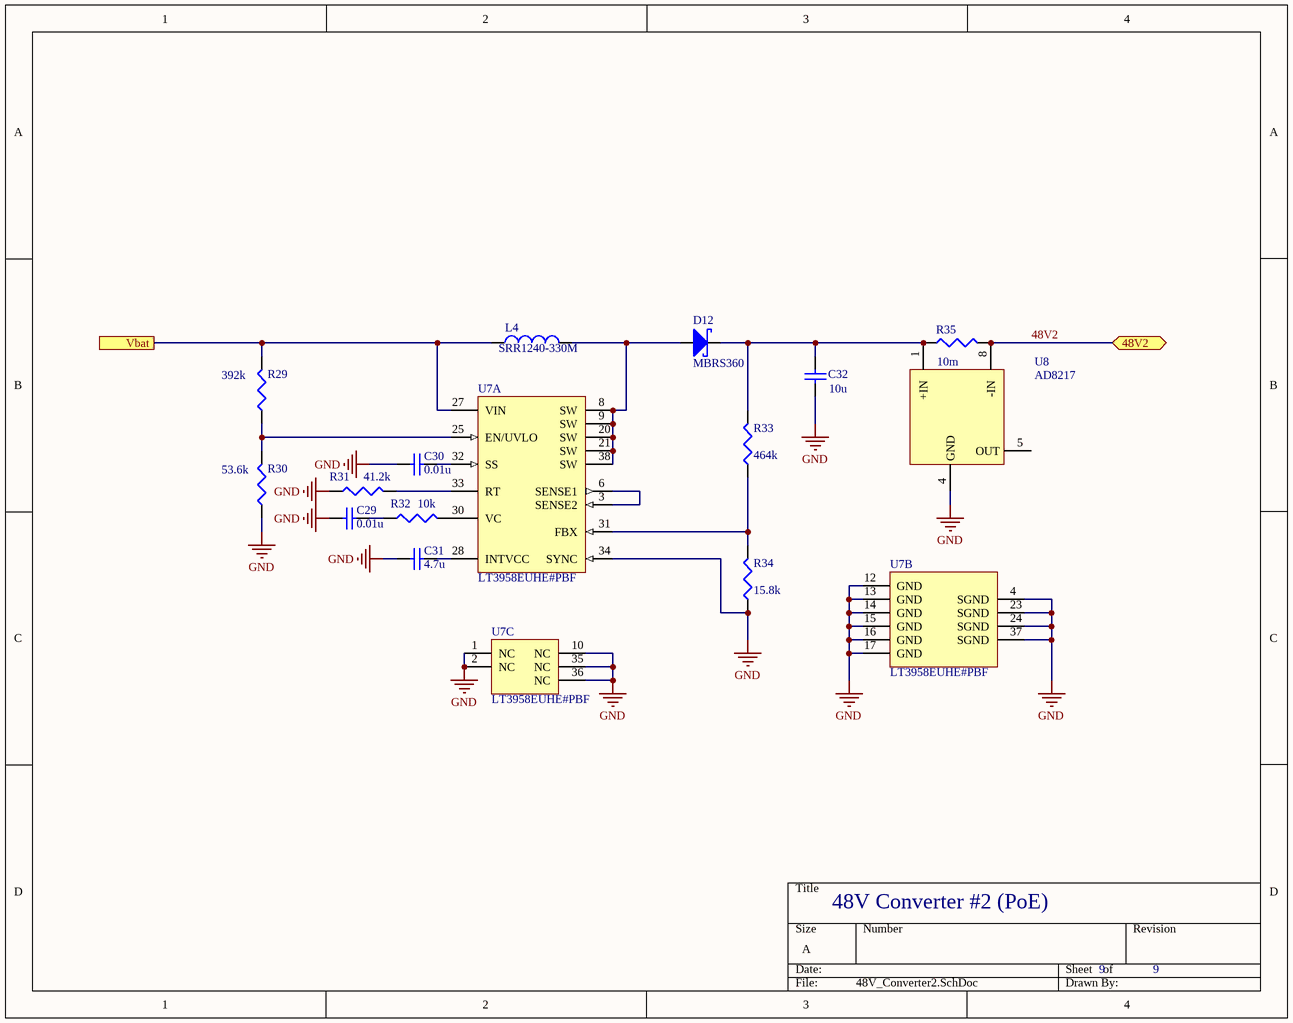
[diagram p4: 48V_Converter2.SchDoc]

### Parts
C29  value 0.01u  [C1206]  (hidden comment: Cap Semi)
C30  value 0.01u  [C1206]  (hidden comment: Cap Semi)
C31  value 4.7u  [C1206]  (hidden comment: Cap Semi)
C32  value 10u  [C1206]  (hidden comment: Cap Semi)
D12  MBRS360  [MBRS360]
L4  SRR1240-330M  [SRR1240]
R29  value 392k  [J1-0603]  (hidden comment: Res3)
R30  value 53.6k  [J1-0603]  (hidden comment: Res3)
R31  value 41.2k  [J1-0603]  (hidden comment: Res3)
R32  value 10k  [J1-0603]  (hidden comment: Res3)
R33  value 464k  [J1-0603]  (hidden comment: Res3)
R34  value 15.8k  [J1-0603]  (hidden comment: Res3)
R35  value 10m  [J1-0603]  (hidden comment: Res3)
U7  LT3958EUHE#PBF  [LT-UHE-36-V-UHE28MA_V]  (parts A,B,C of 3)
U8  AD8217  [AD8217]

### Ports
48V2 (bidir), Vbat

### Nets
GND: C29.1 C30.1 C31.1 C32.1 R30.1 R31.1 R34.1 U7.1(NC) U7.2(NC) U7.4(SGND) U7.10(NC) U7.12(GND) U7.13(GND) U7.14(GND) U7.15(GND) U7.16(GND) U7.17(GND) U7.23(SGND) U7.24(SGND) U7.34(SYNC) U7.35(NC) U7.36(NC) U7.37(SGND) U8.4(GND)
48V2: R35.2 U8.8(-IN) ; port 48V2
Vbat: L4.1 R29.2 U7.27(VIN) ; port Vbat
NetC29_2: C29.2 R32.1
NetC30_2: C30.2 U7.32(SS)
NetC31_2: C31.2 U7.28(INTVCC)
NetC32_2: C32.2 D12.2(Cathode) R33.2 R35.1 U8.1(+IN)
NetD12_1: D12.1(Anode) L4.2 U7.8(SW) U7.9(SW) U7.20(SW) U7.21(SW) U7.38(SW)
NetR29_1: R29.1 R30.2 U7.25(EN/UVLO)
NetR31_2: R31.2 U7.33(RT)
NetR32_2: R32.2 U7.30(VC)
NetR33_1: R33.1 R34.2 U7.31(FBX)
NetU7_3: U7.3(SENSE2) U7.6(SENSE1)

Not connected (* = marked no-connect by the designer): U8 5(OUT)

### Notes on the sheet
- 48V Converter #2 (PoE)

### Library data of the parts
C29-C32 = Cap Semi: Capacitor (Semiconductor SIM Model); Published: 8-Jun-2000; LatestRevisionDate: 29-May-2009; LatestRevisionNote: IPC-7351 Footprint Added.; PackageReference: C1206; Publisher: Altium Limited; PackageDescription: Chip Capacitor
D12 = MBRS360: DIODE SCHOTTKY 60V 3A SMC; Digikey: https://www.digikey.com/product-detail/en/on-semiconductor/MBRS360T3G/MBRS360T3GOSCT-ND/918010; Datasheet: https://www.onsemi.com/pub/Collateral/MBRS360T3-D.PDF
L4 = SRR1240: FIXED IND 33UH 2.3A 97 MOHM SMD; Digikey: https://www.digikey.com/product-detail/en/bourns-inc/SRR1240-330M/SRR1240-330MCT-ND/2127395; Datasheet: https://www.bourns.com/docs/Product-Datasheets/SRR1240.pdf
R29-R35 = Res3: Resistor; Published: 8-Jun-2000; LatestRevisionDate: 29-May-2009; LatestRevisionNote: IPC-7351 Footprint Added.; PackageReference: J1-0603; Publisher: Altium Limited; PackageDescription: Chip Resistor
U7 = LT3958EUHE#PBF: High Input Voltage, Boost, Flyback, SEPIC and Inverting Converter, 36-pin QFN (UHE-36-UHE28MA), -40 to 125 degC, Pb-Free; Manufacturer: Linear Technology; Frequency Adjust Range: 100kHz - 1MHz; Number of Outputs: 1; PackageVersion: Rev. D, 02/2012; PackageReference: UHE-36; PackageDescription: 28-Pin Plastic QFN, Body 5 x 6 mm, Pitch 0.5 mm; Supplier 1: Digi-Key; Supplier Part Number 1: LT3958EUHE#PBF-ND; Supplier 2: Farnell; Supplier Part Number 2: 2294964; Supplier 3: Newark; Supplier Part Number 3: 78R8466; RoHS: TRUE; Mounting Technology: Surface Mount; PartNumber: LT3958EUHE#PBF; ComponentLink1Description: Manufacturer URL; ComponentLink1URL: http://www.linear.com/; ComponentLink2Description: Datasheet; ComponentLink2URL: http://cds.linear.com/docs/en/datasheet/3958f.pdf; ComponentLink3Description: Package Specification; ComponentLink3URL: http://cds.linear.com/docs/en/packaging/QFN_28_05-08-1836.pdf
U8 = AD8217: as U?#1 on sheet 12V_Converter; Datasheet: https://www.analog.com/media/en/technical-documentation/data-sheets/AD8217.pdf

## Nets that join several sheets
GND: Embedded_Circuits (20 pins), Embedded_Chip (19 pins), 12V_Converter (21 pins), 19V_Converter (21 pins), 48V_Converter2 (24 pins)
3V3: Embedded_Circuits (C45.2 P8.1 R45.2 U10.3), Embedded_Chip (6 pins)
19V: 12V_Converter (R?#1.2 U?#1.8), 19V_Converter (R19.2 U4.8)
P1.2_UART0_RXD: Embedded_Circuits (U12.1), Embedded_Chip (U9.6)
P1.3_UART0_TXD: Embedded_Circuits (U12.4), Embedded_Chip (U9.7)
P2.4_LED_RED: Embedded_Circuits (Q11.G), Embedded_Chip (U9.20)
P2.5_LED_GREEN: Embedded_Circuits (Q12.G), Embedded_Chip (U9.21)
P2.6_LED_BLUE: Embedded_Circuits (Q13.G), Embedded_Chip (U9.22)
P4.2_A11_19Vcur: Embedded_Chip (U9.58), 12V_Converter (U?#1.5), 19V_Converter (U4.5)
RST: Embedded_Circuits (5 pins), Embedded_Chip (U9.83)
TCK_SWDCLK: Embedded_Circuits (P8.4), Embedded_Chip (U9.95)
TDI: Embedded_Circuits (P8.8), Embedded_Chip (U9.92)
TDO_SWO: Embedded_Circuits (P8.6), Embedded_Chip (U9.93)
TMS_SWDIO: Embedded_Circuits (P8.2), Embedded_Chip (U9.94)
Vbat: Embedded_Circuits (C44.2 U10.1), Embedded_Chip (R46.2), 12V_Converter (5 pins), 19V_Converter (5 pins), 48V_Converter2 (L4.1 R29.2 U7.27)